# Altium schematic sheet RadioFinish.SchDoc
size A; SheetNumber: 1; SheetTotal: 1
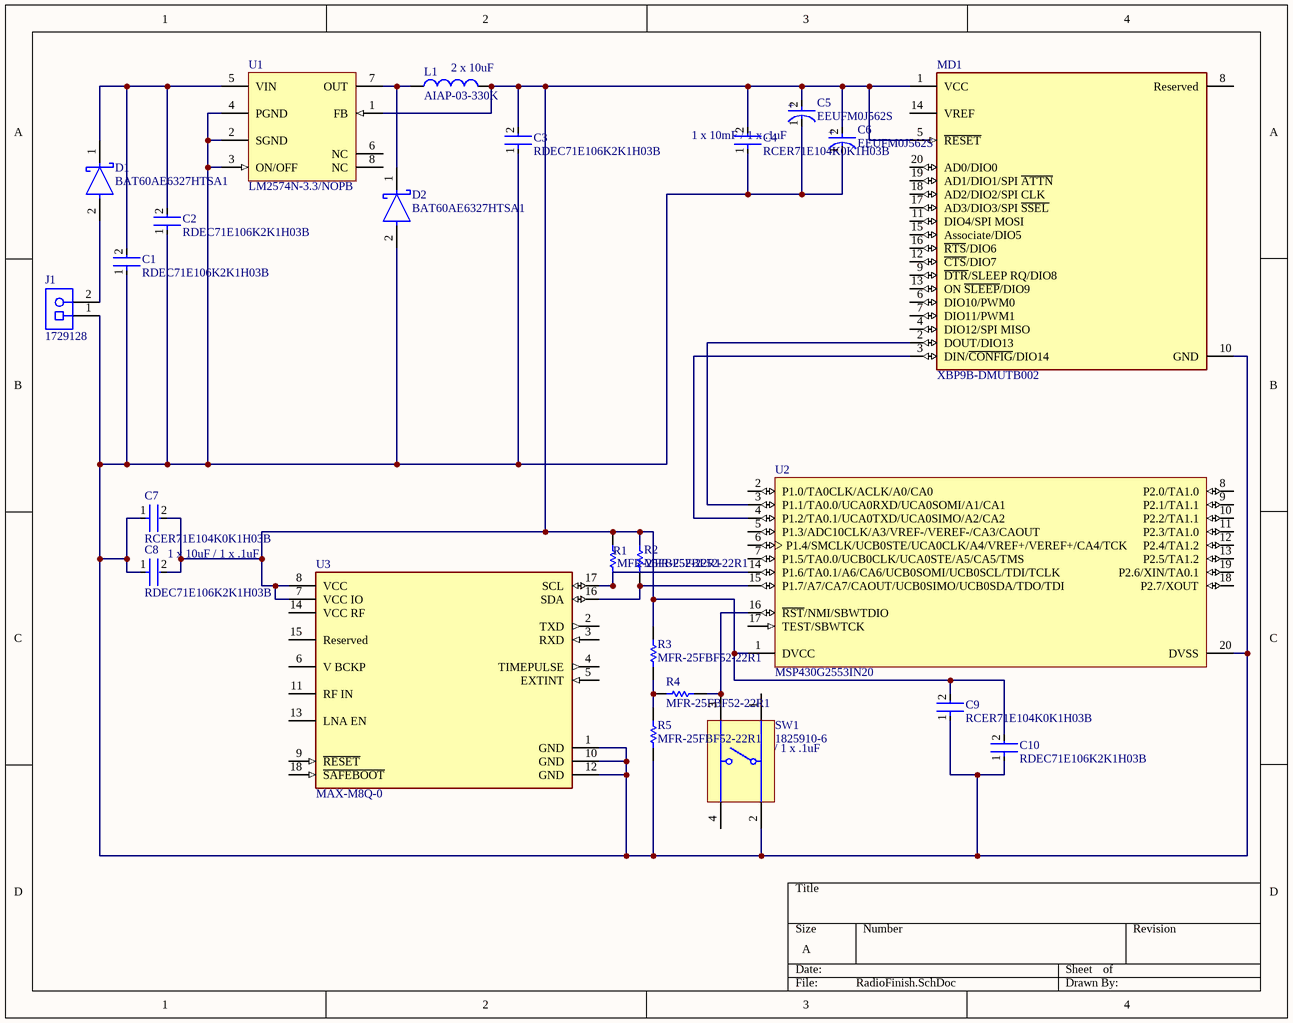
[diagram p0: RadioFinish.SchDoc]

## Parts
C1  RDEC71E106K2K1H03B  [FP-RDE2M1-MFG]
C2  RDEC71E106K2K1H03B  [FP-RDE2M1-MFG]
C3  RDEC71E106K2K1H03B  [FP-RDE2M1-MFG]
C4  RCER71E104K0K1H03B  [FP-RCE0K1-MFG]
C5  EEUFM0J562S  [FP-RAD-TH-D_16_0_5-L_20_2-MFG]
C6  EEUFM0J562S  [FP-RAD-TH-D_16_0_5-L_20_2-MFG]
C7  RCER71E104K0K1H03B  [FP-RCE0K1-MFG]
C8  RDEC71E106K2K1H03B  [FP-RDE2M1-MFG]
C9  RCER71E104K0K1H03B  [FP-RCE0K1-MFG]
C10  RDEC71E106K2K1H03B  [FP-RDE2M1-MFG]
D1  BAT60AE6327HTSA1  [FP-PG-SOD323-2-IPC_C]
D2  BAT60AE6327HTSA1  [FP-PG-SOD323-2-IPC_C]
J1  1729128  [PHOE-1729128-2_V]
L1  AIAP-03-330K  [CAPA81-2290X1140_V]
MD1  XBP9B-DMUTB002  [FP-XBP9B-DMUTB002-MFG]
R1  MFR-25FBF52-22R1  [RESA60-630X240]
R2  MFR-25FBF52-22R1  [RESA60-630X240]
R3  MFR-25FBF52-22R1  [RESA60-630X240]
R4  MFR-25FBF52-22R1  [RESA60-630X240]
R5  MFR-25FBF52-22R1  [RESA60-630X240]
SW1  1825910-6  [TECO-1825910-6_V]
U1  LM2574N-3.3/NOPB  [P0008A]
U2  MSP430G2553IN20  [N0020A]
U3  MAX-M8Q-0  [FP-MAX-M8Q-0-MFG]

## Nets
NetC1_1: C1.1 C2.1 C3.1 C4.1 C5.1(C) C6.1(C) C7.1 C8.1 C9.1 C10.1 D2.2(A) J1.1 MD1.10(GND) R5.1 SW1.2 U1.2(SGND) U1.3(ON/OFF) U1.4(PGND) U2.20(DVSS) U3.1(GND) U3.10(GND) U3.12(GND)
NetC1_2: C1.2 C2.2 D1.1(C) U1.5(VIN)
NetC3_2: C3.2 C4.2 C5.2(A) C6.2(A) C7.2 C8.2 C9.2 C10.2 L1.2 MD1.1(VCC) MD1.5(~{RESET}) R1.2 R2.2 R3.2 U1.1(FB) U2.1(DVCC) U3.7(VCC_IO) U3.8(VCC)
NetD1_2: D1.2(A) J1.2
NetD2_1: D2.1(C) L1.1 U1.7(OUT)
NetMD1_2: MD1.2(DOUT/DIO13) U2.3(P1.1/TA0.0/UCA0RXD/UCA0SOMI/A1/CA1)
NetMD1_3: MD1.3(DIN/~{CONFIG}/DIO14) U2.4(P1.2/TA0.1/UCA0TXD/UCA0SIMO/A2/CA2)
NetR1_1: R1.1 U2.14(P1.6/TA0.1/A6/CA6/UCB0SOMI/UCB0SCL/TDI/TCLK) U3.17(SCL)
NetR2_1: R2.1 U2.15(P1.7/A7/CA7/CAOUT/UCB0SIMO/UCB0SDA/TDO/TDI) U3.16(SDA)
NetR3_1: R3.1 R4.2 R5.2
NetR4_1: R4.1 SW1.3 U2.16(~{RST}/NMI/SBWTDIO)

Not connected (* = marked no-connect by the designer): MD1 4(DIO12/SPI_MISO) 6(DIO10/PWM0) 7(DIO11/PWM1) 8(Reserved) 9(~{DTR}/SLEEP_RQ/DIO8) 11(DIO4/SPI_MOSI) 12(~{CTS}/DIO7) 13(ON_~{SLEEP}/DIO9) 14(VREF) 15(Associate/DIO5) 16(~{RTS}/DIO6) 17(AD3/DIO3/SPI_~{SSEL}) 18(AD2/DIO2/SPI_CLK) 19(AD1/DIO1/SPI_~{ATTN}) 20(AD0/DIO0); SW1 1 4; U1 6(NC) 8(NC); U2 2(P1.0/TA0CLK/ACLK/A0/CA0) 5(P1.3/ADC10CLK/A3/VREF-/VEREF-/CA3/CAOUT) 6(P1.4/SMCLK/UCB0STE/UCA0CLK/A4/VREF+/VEREF+/CA4/TCK) 7(P1.5/TA0.0/UCB0CLK/UCA0STE/A5/CA5/TMS) 8(P2.0/TA1.0) 9(P2.1/TA1.1) 10(P2.2/TA1.1) 11(P2.3/TA1.0) 12(P2.4/TA1.2) 13(P2.5/TA1.2) 17(TEST/SBWTCK) 18(P2.7/XOUT) 19(P2.6/XIN/TA0.1); U3 2(TXD) 3(RXD) 4(TIMEPULSE) 5(EXTINT) 6(V_BCKP) 9(~{RESET}) 11(RF_IN) 13(LNA_EN) 14(VCC_RF) 15(Reserved) 18(~{SAFEBOOT})

## Notes on the sheet
- (near L1) 2 x 10uF
- (near C4) 1 x 10mF / 1 x .1uF
- (near C8) 1 x 10uF / 1 x .1uF
- (near SW1) 1 x 10uF / 1 x .1uF
- (in symbol CMP-05427-001489-1) +

## Library data of the parts
C1-C3 C8 C10 = CMP-06035-050717-1: Ceramic Capacitor 10uF ±10% 25V X7S Radial; Lead/Base Style: Formed Leads; Lead Diameter: 0.5mm; Max Operating Temperature: 125°C; Voltage Rating (DC): 25V; Tolerance: 10%; Termination: Radial; Packaging: Bulk; Voltage Rating: 25V; Mount: Through Hole; Case/Package: Radial; Height: 4mm; Capacitance: 10uF; Resistor Type: Ceramic; Package Quantity: 500; Dielectric: X7S; Height - Seated (Max): 0.236inch; Length: 5.5mm; Width: 0.124inch; Lead Free: Lead Free; Lead Pitch: 0.197inch; Min Operating Temperature: -55°C
C4 C7 C9 = CMP-06035-038410-1: Cap Ceramic 100nF 25V X7R ±10% Radial 5mm +125°C Automotive Bulk
C5 C6 = CMP-05427-001489-1: Aluminum Electrolytic Capacitors (Radial Lead Type) 5600uF ±20% 6.3V; ESR (Equivalent Series Resistance): 17mR; Ripple Current: 3.3A; Lead/Base Style: Straight; Dissipation Factor: 0.22%; Capacitance: 5.6mF; Lead Diameter: 0.8mm; Life (Hours): 5000Hour; Lead Free: Lead Free; Construction: RADIAL; Voltage Rating (DC): 6.3V; Tolerance: 20%; Voltage: 6.3V; Height: 20mm; Radiation Hardening: No; Case/Package: Radial; Series: FM; Package Quantity: 100; Length: 20mm; Packaging: Bulk; Diameter: 16mm; Mount: Through Hole; Termination: Radial; Height - Seated (Max): 0.866inch; Min Operating Temperature: -40°C; Impedance: 17mR; RoHS Compliant: Yes; Max Operating Temperature: 105°C; Lead Pitch: 7.5mm; Voltage Rating: 6.3V; REACH SVHC: No SVHC
D1 D2 = CMP-32890-000004-1: DIODE SCHOTTKY 10V 3A SOD323-2; Forward Voltage: 370mV; Polarity: Standard; Peak Non-Repetitive Surge Current: 5A; Element Configuration: Single; Max Operating Temperature: 85°C; Current Rating: 3A; Number of Pins: 2; Mount: Surface Mount; Forward Current: 3A; Max Reverse Voltage (DC): 10V; Output Current: 3A; Contact Plating: Tin; Average Rectified Current: 3A; Lead Free: Lead Free; Max Repetitive Reverse Voltage (Vrrm): 10V; Voltage Rating (DC): 10V; Radiation Hardening: No; Halogen Free: Not Halogen Free; Case/Package: SOD-323-2; REACH SVHC: No SVHC; Min Operating Temperature: -55°C; Packaging: Tape and Reel
J1 = CMP-2000-05815-1: PCB Terminal Block, 13.5 A, 400 V, 2-Pin THD, RoHS, Bulk; Manufacturer: Phoenix Contact; Package Version: 03/2015; No. of Rows: 1; Pitch: 5.08mm; No. of Positions: 2; Voltage Rating: 400V; Current Rating: 13500mA; Manufacturer URL: http://www.phoenixcontact.com/; Datasheet URL: https://datasheet.ciiva.com/16046/1729128-16046181.pdf; RoHS: TRUE; Package URL: https://www.phoenixcontact.com/online/portal/pi/pxc/product_detail_page/!ut/p/b1/3VdJjqNKFDxLH8AFycySyWY2ozFsEPOMMQaDOX1XedGL_1Vdm5YXJleknhSKeBkvI6EA8ncAo3AYoDhBQGco6KN7VURTdemj9us_IEKEZo_YHiPAEWEFmDGOHMORkqKYCORBZxgL7ZoaZYcbFFUZ3fqxSY6GOuxydWUuHqz1ynmMFygu583Bob0Ewr6Sd_l-5m-kAueHiB0jpRwZwe58wwtkpxtMYd_LmGcDRU02dRNEyWt6Y2ti5pSyJ_reIkzIulrqApdnbT11V5jnCKbYNCvhEM1MCpPByat_X379-iThf08CI5GfOPqfBeS3BRoBOdD55AKVv0iLwCMq-2BrzXWSGRH7pUGD9uwXQjiph3xL0DKQwdGa0JImiIOmBNOestqgwTHSSs2oOep-78apyXQBvNi8ZLaFjvjWvcaUEBu0MC6Wbe-d6mB0FAebo2lUWinqYaZs5DAYzV0RP9yitUjnGJ0iI9xhZkT42OCQNUJJhkgWINNQLP2JFP6OpMg3JCVg70jqHT0lvKOnhHf0lPuOnnLf0VPuWx6_dxwUIvwk5WMkT0kLL1mh61l2yZVSzG3pYV_bqo-mj6uMKwKwdnnW8Jh5RTOJzMOA5c-eJDaZQw4mTMPH02PvS_ZAqNVjVTo2WyYLkwH_KU1mmmG5kjRhDqPXLwwVHvVOjCM60-fpXvTDfMGW1PVFVS1r4e4yVDk4ZdNbkUHvqPqQSeian4UD39fNKmachqdJ1NJbyk8rXT9mXTvPk3oE5meulKGgiruPJek-4I9hTT6G8ZLOyRSm2RRVbThERQad5OS28hdt4YW4vG0stgYYzsWsK4_7y6DZMjJSCqri1kyiZR5vD7pwIrNR7QwPHTcLTI5qT7eRlpHrdGiupYlqQDJ7zy_CND8fWWBoLRXxk1RVcXiBQwbTD4Xi7KL-FuO94t9xaqweXzH; PartNumber: 1729128; Package Description: 2-Pin Through Hole Device, Body 8.1 x 10.16 mm, Pitch 5.08 mm; Datasheet Version: 12/2013; Mounting Technology: ThroughHole; Orientation: Horizontal; Package Reference: 1729128-2; Packing: Bulk
L1 = CMP-2000-05083-1: Axial Power Inductor, 22 uH, +/- 10%, -55 to 125 degC, 2-Pin THD, RoHS, Bulk; Manufacturer: Abracon; Type: Wirewound; Inductance: 22µH; Current Rating: 6.07A; DC Resistance (DCR): 26mOhmMax; Frequency - Test: 1kHz; Shielding: Unshielded; Frequency - Self Resonant: -; Series: AIAP-03; Package Reference: CAPA81-2290X1140; Ratings: -; Q @ Freq: -; Package Description: 2-Pin Axial Lead, Dia 11.4 mm, Body Length 22.9 mm; Operating Temperature: -55degC~125degC; Datasheet URL: http://datasheet.octopart.com/AIAP-03-220K-Abracon-datasheet-38892904.pdf; Family: FixedInductors; Mounting Type: ThroughHole; Datasheet Version: Jan-12; Current - Saturation: -; Packaging: Bulk; Category: Inductors,Coils,Chokes; Size / Dimension: 0.450"Diax0.900"L(11.40mmx22.90mm); Material - Core: -; Tolerance: ±10%; Manufacturer URL: http://www.abracon.com/; Package / Case: Axial; Height - Seated (Max): -
MD1 = CMP-84319-000004-1: RX TXRX MOD ISM < 1GHZ U.FL TH; Max Supply Voltage: 3.6V; Current - Transmitting: 215mA; Sensitivity: -101dBm; Min Frequency: 902MHz; Memory Size: 2KB; Max Frequency: 928MHz; Min Supply Voltage: 2.4V; Current - Receiving: 29mA; Interface: SPI; Data Rate: 200Kbps; Frequency: 900MHz; Output Power (dBm): 24dBm; Number of Pins: 20; Series: XBee-Pro™; Max Operating Temperature: 85°C; Radiation Hardening: No; Min Operating Temperature: -40°C; Package Quantity: 1; RAM Size: 2KB; Packaging: Bulk; Case/Package: Module
R1-R5 = CMP-1659-00076-1: Axial Resistor, 22.1 Ohm, +/- 1%, 250 mW, -55 to 155 degC, 2-Pin THD, RoHS, Bulk; Resistance: 2.21 kohm; Voltage Rating: 250 V; Power Rating: 250 mW; Mount: Through Hole; Package Quantity: 200; Max Operating Temperature: 155 degC; ComponentLink2URL: http://www.yageo.com/documents/recent/Yageo%20LR_MFR_2013.pdf; DatasheetVersion: Apr-13; PackageDescription: 2-Pin Axial Lead, Dia 2.4 mm, Body Length 6.3 mm; ComponentLink1Description: Manufacturer URL; Tolerance: 1%; Case\Package: Axial; Packaging: Bulk; ComponentLink2Description: Datasheet; Length: 0.248 inch; ComponentLink1URL: http://www.yageo.com/; Min Operating Temperature: -55 degC; RoHSCompliant: true; PackageReference: MFR-25
SW1 = CMP-1684-00021-1: Tact Switch, SPST-NO, 0.05 A, -35 to 85 degC, 4-Pin THD, RoHS, Bulk; Manufacturer: TE Connectivity; Maximum Contact Resistance: 100mOhm; Mechanical Life: 100000Cycles; Bushing Type: Unthreaded; Switch Configuration: OFF(ON); Maximum DC Voltage Rating: 24V; Contact Rating @ Voltage: 0.05A@24VDC; Actuator Color: Black; Body Orientation: Straight; Function: MomentaryContact; Illumination: N/R; Actuator Style: RoundButton; Actuator Material: PolybutyleneTerephthalate; Dielectric Strength: 500VAC; Pole Throw Configuration: SPST; Actuator Length: 1.4mm; Product Weight: N/A; Contact Material: CopperAlloy; Housing Material: N/A; Terminal Type: PCPins; Minimum Insulation Resistance: 100MOhm; Package Description: 4-Pin Through Hole Device, Body 5.99 x 5.99 mm, Pitch 6.5 mm; Part No: 1825910-6; Package Reference: THD; Base Material: N/A; Manufacturer URL: http://www.te.com; Contact Plating: Silver; RoHS: Yes; Datasheet Version: Rev. C9; Electrical Life: 100000Cycles; Maximum AC Voltage Rating: N/A; Thread Size: N/R; Operating Temperature: -35to85C; Mounting: ThroughHole; Dimension: 5.99x5mm; Datasheet URL: http://www.te.com/commerce/DocumentDelivery/DDEController?Action=showdoc&DocId=Customer+Drawing%7F1825910%7FC9%7Fpdf%7FEnglish%7FENG_CD_1825910_C9.pdf%7F1825910-6; Family: 1825910; Seal Location: N/A; Seal Description: N/A; Packaging: N/A
U1 = CMP-0069-00460-3: SIMPLE SWITCHER® 0.5A Step-Down Voltage Regulator, 8-pin MDIP, Pb-Free; Manufacturer: Texas Instruments; PackageTopMarking: NSUZXYTTE#*LM2574N*-3.3 P+; PowerWise: N; CompType: Switcher; PackageReference: P0008A; ComponentLink1URL: http://www.ti.com/general/docs/lit/getliterature.tsp?genericPartNumber=LM2574&fileType=pdf; PinCount: 8; RoHS: Y; ComponentLink1Description: Datasheet URL; Code_JEDEC: MS-001-BA; PackageDescription: MDIP, .365 x .250 x .130in, 8 Lead, .100in Pitch
U2 = CMP-0365-00184-2: 16 MHz Mixed Signal Microcontroller with 16 KB Flash, 512 B SRAM and 24 GPIOs, -40 to 85 degC, 20-pin DIP (N), Pb-Free (RoHS); Manufacturer: Texas Instruments; USCI_B (I2C & SPI): 1; Temp Sensor: Yes; SubFamily: Value Line; Frequency(MHz): 16; ADC Channels: 8; SRAM(B): 512; ADC: 10-bit SAR; GPIO: 24; Timers - 16-bit: 2; Code_JEDEC: MS-001; Eco-Plan: Pb-Free (RoHS); PartNumber: MSP430G2553IN20; ComponentLink1URL: http://www.ti.com/; PackageVersion: 4040049/E; Comparators: Yes; Watchdog: Yes; ComponentLink2Description: Datasheet; ComponentLink1Description: Manufacturer URL; Mounting Technology: Through Hole; ComponentLink2URL: http://www.ti.com/general/docs/lit/getliterature.tsp?genericPartNumber=MSP430G2553&fileType=pdf; Brown Out Reset: Yes; PackageReference: N0020A; PackageDescription: 20-Pin Plastic In-Line, Body 25.40 x 6.35 mm, Pitch 2.54 mm; ComponentLink3URL: http://www.ti.com/litv/pdf/mpds177g; ComponentLink3Description: Package Specification; Flash(KB): 16; Cap touch I/O: Yes; USCI_A (UART/LIN/IrDA/SPI): 1; DatasheetVersion: SLAS735G
U3 = CMP-207130-000017-1: RF RCVR GNSS/GPS 1.575GHZ 18LCC; Sensitivity: -167dBm; Current - Receiving: 23mA; Interface: I2C; Frequency: 1.575GHz; Min Operating Temperature: -40°C; Case/Package: SMD/SMT; RoHS Compliant: Yes; Packaging: Cut Tape; Max Operating Temperature: 85°C